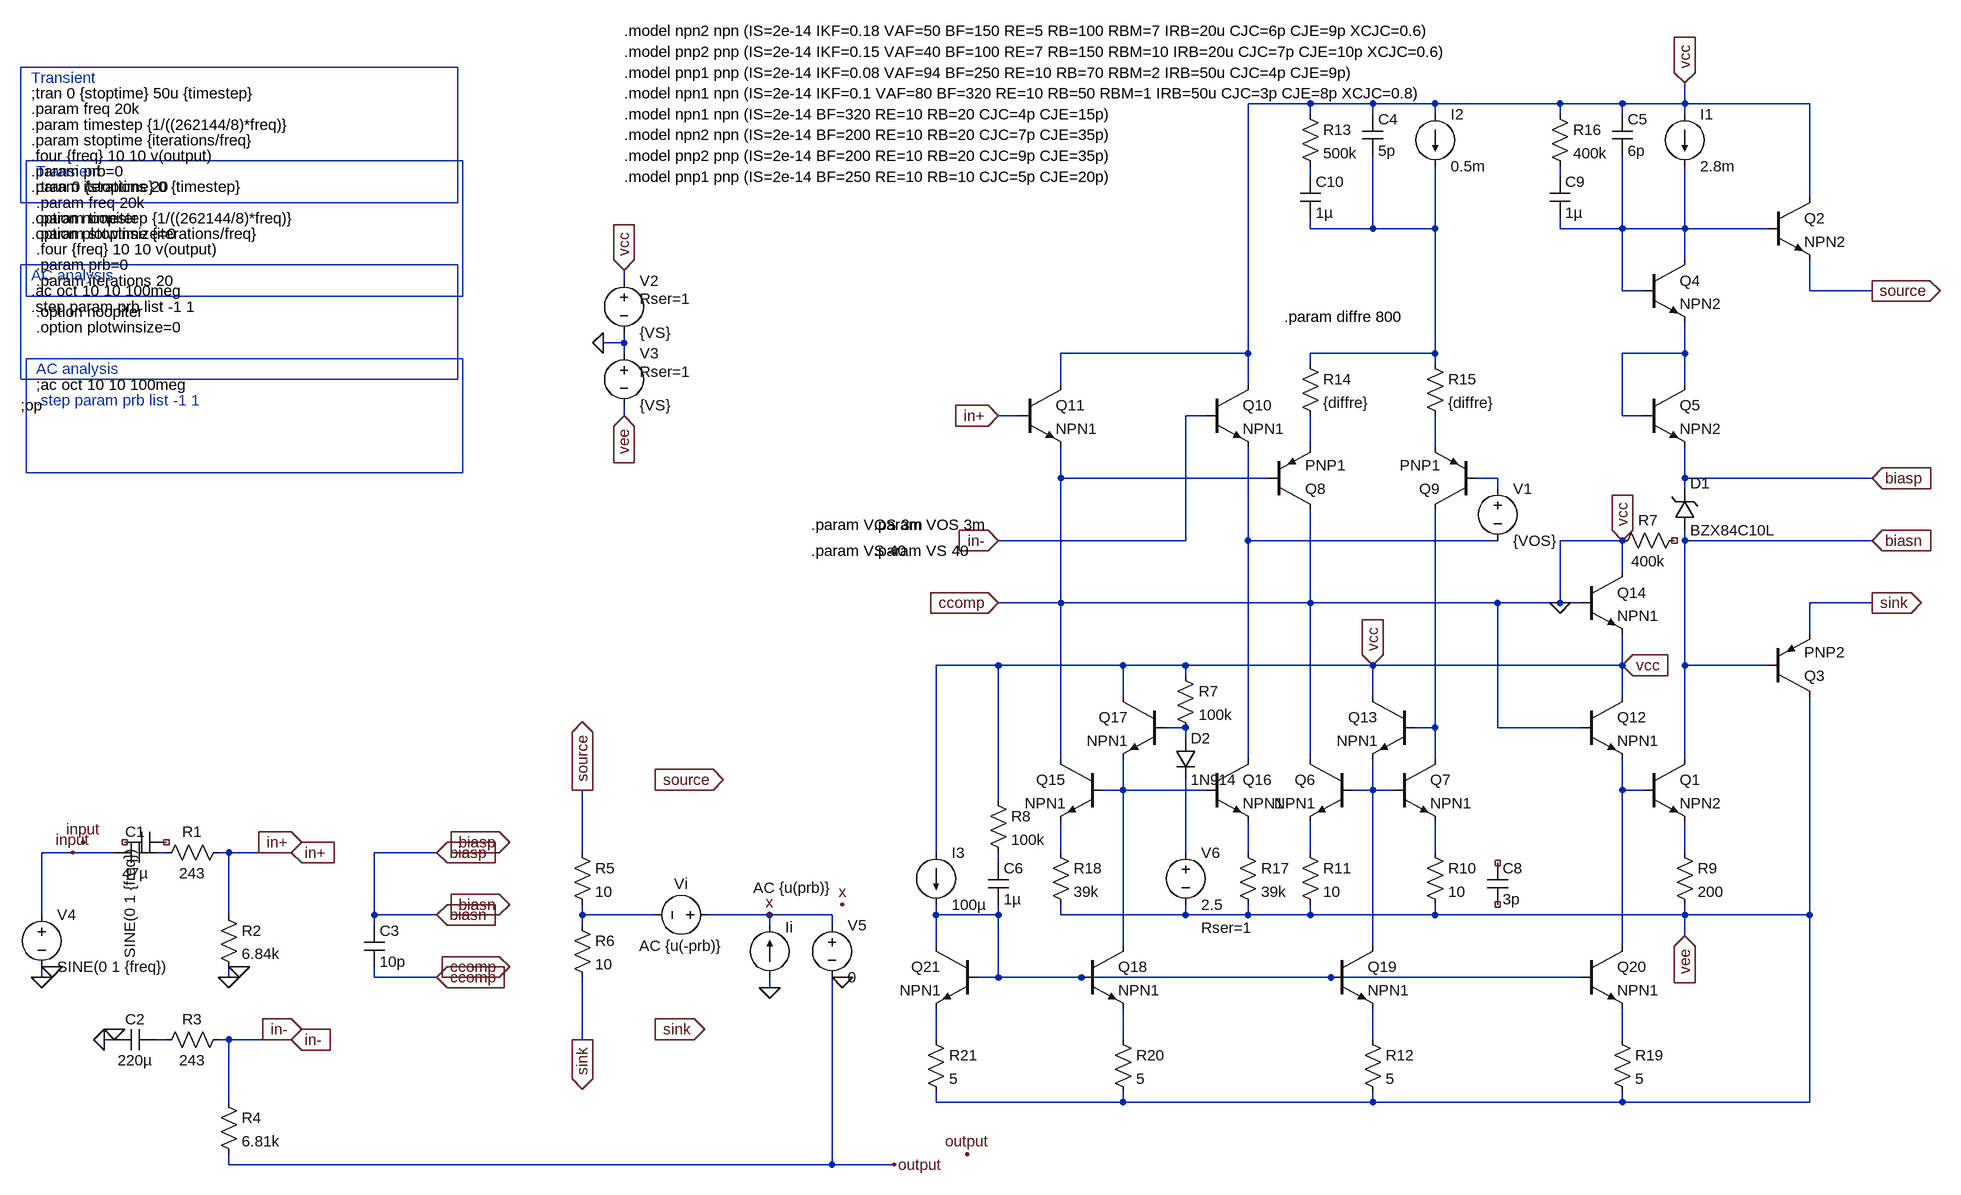
[diagram p0: schematic model_LME49810.asc]
model_LME49810.asc, the LTspice schematic file:
Version 4
SHEET 1 1204 680
WIRE 0 -1184 -96 -1184
WIRE 96 -1184 0 -1184
WIRE 192 -1184 96 -1184
WIRE 384 -1184 192 -1184
WIRE 480 -1184 384 -1184
WIRE 576 -1184 576 -1216
WIRE 576 -1184 480 -1184
WIRE 768 -1184 576 -1184
WIRE 0 -1168 0 -1184
WIRE 96 -1168 96 -1184
WIRE 192 -1168 192 -1184
WIRE 384 -1168 384 -1184
WIRE 480 -1168 480 -1184
WIRE 576 -1168 576 -1184
WIRE 0 -1072 0 -1088
WIRE 384 -1072 384 -1088
WIRE 768 -1040 768 -1184
WIRE 0 -992 0 -1008
WIRE 96 -992 96 -1104
WIRE 96 -992 0 -992
WIRE 192 -992 192 -1088
WIRE 192 -992 96 -992
WIRE 384 -992 384 -1008
WIRE 480 -992 480 -1104
WIRE 480 -992 384 -992
WIRE 576 -992 576 -1088
WIRE 576 -992 480 -992
WIRE 704 -992 576 -992
WIRE 576 -944 576 -992
WIRE -1056 -912 -1056 -928
WIRE 480 -896 480 -992
WIRE 512 -896 480 -896
WIRE 768 -896 768 -944
WIRE 864 -896 768 -896
WIRE -1056 -816 -1056 -832
WIRE -1056 -816 -1088 -816
WIRE -1056 -800 -1056 -816
WIRE -96 -800 -96 -1184
WIRE -96 -800 -384 -800
WIRE 192 -800 192 -992
WIRE 192 -800 0 -800
WIRE 576 -800 576 -848
WIRE 576 -800 480 -800
WIRE 0 -784 0 -800
WIRE 192 -784 192 -800
WIRE -384 -752 -384 -800
WIRE -96 -752 -96 -800
WIRE 576 -752 576 -800
WIRE -1056 -704 -1056 -720
WIRE -448 -704 -480 -704
WIRE -160 -704 -192 -704
WIRE 480 -704 480 -800
WIRE 512 -704 480 -704
WIRE 0 -656 0 -704
WIRE 192 -656 192 -704
WIRE -384 -608 -384 -656
WIRE -64 -608 -384 -608
WIRE 288 -608 256 -608
WIRE 576 -608 576 -656
WIRE 864 -608 576 -608
WIRE 288 -592 288 -608
WIRE 576 -592 576 -608
WIRE -192 -512 -192 -704
WIRE -192 -512 -480 -512
WIRE -96 -512 -96 -656
WIRE 288 -512 -96 -512
<<<<<<< .mine
WIRE 480 -512 384 -512
=======
>>>>>>> .r9
WIRE 576 -512 576 -528
WIRE 864 -512 576 -512
WIRE 480 -464 480 -512
WIRE 0 -416 0 -560
<<<<<<< .mine
WIRE 0 -416 -384 -416
WIRE 384 -416 384 -512
WIRE 384 -416 0 -416
=======
WIRE 0 -416 -480 -416
WIRE 288 -416 0 -416
WIRE 416 -416 384 -416
>>>>>>> .r9
WIRE 864 -416 768 -416
WIRE 768 -368 768 -416
WIRE -480 -320 -576 -320
WIRE -288 -320 -480 -320
WIRE -192 -320 -288 -320
WIRE 96 -320 -192 -320
WIRE 480 -320 480 -368
WIRE 480 -320 96 -320
WIRE 576 -320 576 -512
WIRE 704 -320 576 -320
WIRE -192 -304 -192 -320
WIRE -288 -272 -288 -320
WIRE 96 -272 96 -320
WIRE 480 -272 480 -320
WIRE -192 -224 -224 -224
WIRE 192 -224 192 -560
WIRE 192 -224 160 -224
WIRE 288 -224 288 -416
WIRE 416 -224 288 -224
WIRE -192 -208 -192 -224
WIRE -384 -176 -384 -608
WIRE -96 -176 -96 -512
WIRE 0 -176 0 -416
WIRE 192 -176 192 -224
WIRE 576 -176 576 -320
WIRE -288 -128 -288 -176
WIRE -288 -128 -320 -128
WIRE -160 -128 -288 -128
WIRE 96 -128 96 -176
WIRE 96 -128 64 -128
WIRE 128 -128 96 -128
WIRE 480 -128 480 -176
WIRE 512 -128 480 -128
WIRE -480 -112 -480 -320
WIRE -1904 -32 -1952 -32
WIRE -1840 -32 -1904 -32
WIRE -1760 -32 -1776 -32
WIRE -1664 -32 -1680 -32
WIRE -1568 -32 -1664 -32
WIRE -1344 -32 -1440 -32
WIRE -1120 -32 -1120 -128
WIRE -576 -32 -576 -320
WIRE -384 -32 -384 -80
WIRE -192 -32 -192 -144
WIRE -96 -32 -96 -80
WIRE 0 -32 0 -80
WIRE 192 -32 192 -80
WIRE 576 -32 576 -80
WIRE -480 -16 -480 -32
WIRE -1952 64 -1952 -32
WIRE -1664 64 -1664 -32
WIRE -1440 64 -1440 -32
WIRE -1344 64 -1440 64
WIRE -1120 64 -1120 48
WIRE -1008 64 -1120 64
WIRE -832 64 -928 64
WIRE -736 64 -832 64
WIRE -576 64 -576 48
WIRE -480 64 -480 48
WIRE -480 64 -576 64
WIRE -384 64 -384 48
WIRE -192 64 -192 48
WIRE -192 64 -384 64
WIRE -96 64 -96 48
WIRE -96 64 -192 64
WIRE 0 64 0 48
WIRE 0 64 -96 64
WIRE 192 64 192 48
WIRE 192 64 0 64
WIRE 576 64 576 48
WIRE 576 64 192 64
WIRE 768 64 768 -272
WIRE 768 64 576 64
WIRE -1440 80 -1440 64
WIRE -1120 80 -1120 64
WIRE -832 80 -832 64
WIRE -736 80 -736 64
WIRE 576 96 576 64
WIRE -576 112 -576 64
WIRE -288 112 -288 -128
WIRE 96 112 96 -128
WIRE 480 112 480 -128
WIRE -1952 160 -1952 144
WIRE -1664 160 -1664 144
WIRE -1440 160 -1440 144
WIRE -1344 160 -1440 160
WIRE -480 160 -480 64
WIRE -480 160 -512 160
WIRE -352 160 -480 160
WIRE 32 160 -352 160
WIRE 416 160 32 160
WIRE -832 176 -832 160
WIRE -1840 256 -1856 256
WIRE -1760 256 -1776 256
WIRE -1664 256 -1680 256
WIRE -1568 256 -1664 256
WIRE -1120 256 -1120 160
WIRE -576 256 -576 208
WIRE -288 256 -288 208
WIRE 96 256 96 208
WIRE 480 256 480 208
WIRE -1664 352 -1664 256
WIRE -576 352 -576 336
WIRE -288 352 -288 336
WIRE -288 352 -576 352
WIRE 96 352 96 336
WIRE 96 352 -288 352
WIRE 480 352 480 336
WIRE 480 352 96 352
WIRE 768 352 768 64
WIRE 768 352 480 352
WIRE -1664 448 -1664 432
WIRE -736 448 -736 160
WIRE -736 448 -1664 448
WIRE -640 448 -736 448
FLAG -480 -704 in+
IOPIN -480 -704 In
FLAG -480 -512 in-
IOPIN -480 -512 In
FLAG -480 -416 ccomp
IOPIN -480 -416 In
FLAG 576 96 vee
IOPIN 576 96 In
FLAG 576 -1216 vcc
IOPIN 576 -1216 In
FLAG 864 -896 source
IOPIN 864 -896 Out
FLAG 864 -416 sink
IOPIN 864 -416 Out
FLAG 864 -608 biasp
IOPIN 864 -608 In
FLAG 864 -512 biasn
IOPIN 864 -512 In
FLAG -1056 -928 vcc
IOPIN -1056 -928 In
FLAG -1056 -704 vee
IOPIN -1056 -704 In
FLAG -1088 -816 0
<<<<<<< .mine
FLAG -1936 144 0
FLAG -1648 144 0
FLAG -1552 -48 in+
IOPIN -1552 -48 In
FLAG -1840 240 0
FLAG -528 432 output
FLAG -1552 240 in-
IOPIN -1552 240 In
FLAG -1888 -48 input
FLAG -1232 -48 biasp
IOPIN -1232 -48 In
FLAG -1232 48 biasn
IOPIN -1232 48 In
FLAG -1232 144 ccomp
IOPIN -1232 144 In
FLAG -1008 -144 source
IOPIN -1008 -144 Out
FLAG -1008 240 sink
IOPIN -1008 240 Out
FLAG -720 160 0
FLAG -720 48 x
FLAG 480 -320 vcc
IOPIN 480 -320 In
FLAG 96 -320 vcc
IOPIN 96 -320 In
=======
FLAG -1952 160 0
FLAG -1664 160 0
FLAG -1568 -32 in+
IOPIN -1568 -32 In
FLAG -1856 256 0
FLAG -640 448 output
FLAG -1568 256 in-
IOPIN -1568 256 In
FLAG -1904 -32 input
FLAG -1344 -32 biasp
IOPIN -1344 -32 In
FLAG -1344 64 biasn
IOPIN -1344 64 In
FLAG -1344 160 ccomp
IOPIN -1344 160 In
FLAG -1120 -128 source
IOPIN -1120 -128 Out
FLAG -1120 256 sink
IOPIN -1120 256 Out
FLAG -832 176 0
FLAG -832 64 x
FLAG 384 -416 0
FLAG 480 -512 vcc
IOPIN 480 -512 In
>>>>>>> .r9
SYMBOL npn 512 -176 R0
SYMATTR InstName Q1
SYMATTR Value NPN2
SYMBOL current 576 -1168 R0
WINDOW 123 0 0 Left 0
WINDOW 39 0 0 Left 0
SYMATTR InstName I1
SYMATTR Value 2.8m
SYMBOL npn 704 -1040 R0
SYMATTR InstName Q2
SYMATTR Value NPN2
SYMBOL pnp 704 -272 M180
SYMATTR InstName Q3
SYMATTR Value PNP2
SYMBOL npn 512 -944 R0
SYMATTR InstName Q4
SYMATTR Value NPN2
SYMBOL npn 512 -752 R0
SYMATTR InstName Q5
SYMATTR Value NPN2
SYMBOL voltage -1056 -928 R0
WINDOW 123 0 0 Left 0
WINDOW 39 24 44 Left 0
SYMATTR SpiceLine Rser=1
SYMATTR InstName V2
SYMATTR Value {VS}
SYMBOL voltage -1056 -816 R0
WINDOW 123 0 0 Left 0
WINDOW 39 24 44 Left 0
SYMATTR SpiceLine Rser=1
SYMATTR InstName V3
SYMATTR Value {VS}
SYMBOL voltage -1952 48 R0
WINDOW 123 0 0 Left 0
WINDOW 39 0 0 Left 0
SYMATTR InstName V4
<<<<<<< .mine
SYMATTR Value SINE(0 1 {freq})
SYMBOL cap -1760 -64 R90
=======
SYMATTR Value SINE(0 1 {freq})
SYMBOL cap -1776 -48 R90
>>>>>>> .r9
WINDOW 0 0 32 VBottom 0
WINDOW 3 32 32 VTop 0
SYMATTR InstName C1
SYMATTR Value 47µ
SYMBOL res -1664 -48 R90
WINDOW 0 0 56 VBottom 0
WINDOW 3 32 56 VTop 0
SYMATTR InstName R1
SYMATTR Value 243
SYMBOL res -1680 48 R0
SYMATTR InstName R2
SYMATTR Value 6.84k
SYMBOL cap -1776 240 R90
WINDOW 0 0 32 VBottom 0
WINDOW 3 32 32 VTop 0
SYMATTR InstName C2
SYMATTR Value 220µ
SYMBOL res -1664 240 R90
WINDOW 0 0 56 VBottom 0
WINDOW 3 32 56 VTop 0
SYMATTR InstName R3
SYMATTR Value 243
SYMBOL res -1680 336 R0
SYMATTR InstName R4
SYMATTR Value 6.81k
SYMBOL cap -1456 80 R0
SYMATTR InstName C3
SYMATTR Value 10p
SYMBOL res -1136 -48 R0
SYMATTR InstName R5
SYMATTR Value 10
SYMBOL res -1136 64 R0
SYMATTR InstName R6
SYMATTR Value 10
SYMBOL current -832 160 M180
WINDOW 0 24 77 Left 0
WINDOW 3 24 0 Left 0
WINDOW 123 -25 138 Left 0
WINDOW 39 0 0 Left 0
SYMATTR InstName Ii
SYMATTR Value ""
SYMATTR Value2 AC {u(prb)}
SYMBOL voltage -912 64 M270
WINDOW 0 32 56 VTop 0
WINDOW 3 -32 56 VBottom 0
WINDOW 123 -32 56 VBottom 0
WINDOW 39 -32 56 VBottom 0
SYMATTR InstName Vi
SYMATTR Value ""
SYMATTR Value2 AC {u(-prb)}
SYMBOL voltage -736 64 R0
WINDOW 123 0 0 Left 0
WINDOW 39 0 0 Left 0
SYMATTR InstName V5
SYMATTR Value 0
SYMBOL cap 464 -1168 R0
SYMATTR InstName C5
SYMATTR Value 6p
SYMBOL zener 560 -528 M180
WINDOW 0 24 72 Left 0
WINDOW 3 24 0 Left 0
SYMATTR InstName D1
SYMATTR Value BZX84C10L
SYMATTR Description Diode
SYMATTR Type diode
SYMBOL npn 64 -176 M0
SYMATTR InstName Q6
SYMATTR Value NPN1
SYMBOL npn 128 -176 R0
SYMATTR InstName Q7
SYMATTR Value NPN1
SYMBOL res 176 -48 R0
SYMATTR InstName R10
SYMATTR Value 10
SYMBOL res -16 -48 R0
SYMATTR InstName R11
SYMATTR Value 10
SYMBOL pnp -64 -560 M180
SYMATTR InstName Q8
SYMATTR Value PNP1
SYMBOL pnp 256 -560 R180
SYMATTR InstName Q9
SYMATTR Value PNP1
SYMBOL current 192 -1168 R0
WINDOW 123 0 0 Left 0
WINDOW 39 0 0 Left 0
SYMATTR InstName I2
SYMATTR Value 0.5m
SYMBOL cap 80 -1168 R0
SYMATTR InstName C4
SYMATTR Value 5p
SYMBOL res -16 -1184 R0
SYMATTR InstName R13
SYMATTR Value 500k
SYMBOL res -16 -800 R0
SYMATTR InstName R14
SYMATTR Value {diffre}
SYMBOL res 176 -800 R0
SYMATTR InstName R15
SYMATTR Value {diffre}
SYMBOL voltage 288 -608 R0
WINDOW 123 0 0 Left 0
WINDOW 39 0 0 Left 0
SYMATTR InstName V1
SYMATTR Value {VOS}
SYMBOL npn -160 -752 R0
SYMATTR InstName Q10
SYMATTR Value NPN1
SYMBOL npn -448 -752 R0
SYMATTR InstName Q11
SYMATTR Value NPN1
SYMBOL npn 416 -272 R0
SYMATTR InstName Q12
SYMATTR Value NPN1
SYMBOL npn 160 -272 M0
SYMATTR InstName Q13
SYMATTR Value NPN1
SYMBOL cap -16 -1072 R0
SYMATTR InstName C10
SYMATTR Value 1µ
SYMBOL res 560 -48 R0
SYMATTR InstName R9
SYMATTR Value 200
SYMBOL res 368 -1184 R0
SYMATTR InstName R16
SYMATTR Value 400k
SYMBOL cap 368 -1072 R0
SYMATTR InstName C9
SYMATTR Value 1µ
SYMBOL npn 416 -464 R0
SYMATTR InstName Q14
SYMATTR Value NPN1
SYMBOL npn -320 -176 M0
SYMATTR InstName Q15
SYMATTR Value NPN1
SYMBOL npn -160 -176 R0
SYMATTR InstName Q16
SYMATTR Value NPN1
SYMBOL res -112 -48 R0
SYMATTR InstName R17
SYMATTR Value 39k
SYMBOL res -400 -48 R0
SYMATTR InstName R18
SYMATTR Value 39k
SYMBOL npn -224 -272 M0
SYMATTR InstName Q17
SYMATTR Value NPN1
SYMBOL res -208 -320 R0
SYMATTR InstName R7
SYMATTR Value 100k
SYMBOL voltage -192 -48 R0
WINDOW 123 0 0 Left 0
WINDOW 39 24 132 Left 0
SYMATTR SpiceLine Rser=1
SYMATTR InstName V6
SYMATTR Value 2.5
SYMBOL diode -208 -208 R0
SYMATTR InstName D2
SYMATTR Value 1N914
SYMBOL npn -352 112 R0
SYMATTR InstName Q18
SYMATTR Value NPN1
SYMBOL npn 32 112 R0
SYMATTR InstName Q19
SYMATTR Value NPN1
SYMBOL npn 416 112 R0
SYMATTR InstName Q20
SYMATTR Value NPN1
SYMBOL res 80 240 R0
SYMATTR InstName R12
SYMATTR Value 5
SYMBOL res 464 240 R0
SYMATTR InstName R19
SYMATTR Value 5
SYMBOL res -304 240 R0
SYMATTR InstName R20
SYMATTR Value 5
SYMBOL npn -512 112 M0
SYMATTR InstName Q21
SYMATTR Value NPN1
SYMBOL res -592 240 R0
SYMATTR InstName R21
SYMATTR Value 5
SYMBOL current -576 -32 R0
WINDOW 123 0 0 Left 0
WINDOW 39 0 0 Left 0
SYMATTR InstName I3
SYMATTR Value 100µ
SYMBOL res -496 -128 R0
SYMATTR InstName R8
<<<<<<< .mine
SYMATTR Value 100k
SYMBOL cap 272 -16 R0
SYMATTR InstName C8
SYMATTR Value 3p
SYMBOL res 576 -528 R90
WINDOW 0 0 56 VBottom 0
WINDOW 3 32 56 VTop 0
SYMATTR InstName R7
SYMATTR Value 1e9
TEXT -672 -536 Left 0 !.param VOS 3m
TEXT -1056 -1168 Left 0 !.model npn1 npn (IS=2e-14 BF=320 RE=10 RB=20 CJC=4p CJE=15p)
TEXT -1056 -1136 Left 0 !.model npn2 npn (IS=2e-14 BF=200 RE=10 RB=20 CJC=7p CJE=35p)
TEXT -1056 -1104 Left 0 !.model pnp2 pnp (IS=2e-14 BF=200 RE=10 RB=20 CJC=9p CJE=35p)
TEXT -672 -496 Left 0 !.param VS 40
TEXT -1056 -1072 Left 0 !.model pnp1 pnp (IS=2e-14 BF=250 RE=10 RB=10 CJC=5p CJE=20p)
=======
SYMATTR Value 400k
SYMBOL cap -496 -16 R0
SYMATTR InstName C6
SYMATTR Value 1µ
TEXT -768 -536 Left 0 !.param VOS 3m
TEXT -1056 -1200 Left 0 !.model npn1 npn (IS=2e-14 IKF=0.1 VAF=80 BF=320 RE=10 RB=50 RBM=1 IRB=50u CJC=3p CJE=8p XCJC=0.8)
TEXT -1056 -1296 Left 0 !.model npn2 npn (IS=2e-14 IKF=0.18 VAF=50 BF=150 RE=5 RB=100 RBM=7 IRB=20u CJC=6p CJE=9p XCJC=0.6)
TEXT -1056 -1264 Left 0 !.model pnp2 pnp (IS=2e-14 IKF=0.15 VAF=40 BF=100 RE=7 RB=150 RBM=10 IRB=20u CJC=7p CJE=10p XCJC=0.6)
TEXT -768 -496 Left 0 !.param VS 40
TEXT -1056 -1232 Left 0 !.model pnp1 pnp (IS=2e-14 IKF=0.08 VAF=94 BF=250 RE=10 RB=70 RBM=2 IRB=50u CJC=4p CJE=9p)
>>>>>>> .r9
TEXT -40 -856 Left 0 !.param diffre 800
<<<<<<< .mine
TEXT -1960 -840 Left 0 !.option plotwinsize=0
TEXT -1960 -864 Left 0 !.option noopiter
TEXT -1960 -1056 Left 0 !.tran 0 {stoptime} 0 {timestep}
TEXT -1960 -1080 Left 0 ;Transient
TEXT -1960 -960 Left 0 !.four {freq} 10 10 v(output)
TEXT -1960 -936 Left 0 !.param prb=0
TEXT -1960 -1008 Left 0 !.param timestep {1/((262144/8)*freq)}
TEXT -1960 -1032 Left 0 !.param freq 20k
TEXT -1960 -984 Left 0 !.param stoptime {iterations/freq}
TEXT -1960 -752 Left 0 !;ac oct 10 10 100meg
TEXT -1960 -728 Left 0 ;.step param prb list -1 1
TEXT -1960 -776 Left 0 ;AC analysis
TEXT -1960 -912 Left 0 !.param iterations 20
RECTANGLE Normal -1304 -1096 -1976 -888
RECTANGLE Normal -1304 -792 -1976 -616
=======
TEXT -1968 -984 Left 0 !.option plotwinsize=0
TEXT -1968 -1008 Left 0 !.option noopiter
TEXT -1968 -1200 Left 0 !;tran 0 {stoptime} 50u {timestep}
TEXT -1968 -1224 Left 0 ;Transient
TEXT -1968 -1104 Left 0 !.four {freq} 10 10 v(output)
TEXT -1968 -1080 Left 0 !.param prb=0
TEXT -1968 -1152 Left 0 !.param timestep {1/((262144/8)*freq)}
TEXT -1968 -1176 Left 0 !.param freq 20k
TEXT -1968 -1128 Left 0 !.param stoptime {iterations/freq}
TEXT -1968 -896 Left 0 !.ac oct 10 10 100meg
TEXT -1968 -872 Left 0 !.step param prb list -1 1
TEXT -1968 -920 Left 0 ;AC analysis
TEXT -1968 -1056 Left 0 !.param iterations 20
TEXT -1984 -720 Left 0 !;op
RECTANGLE Normal -1312 -1240 -1984 -1032
RECTANGLE Normal -1312 -936 -1984 -760
>>>>>>> .r9

The netlist it stands for:
* model_LME49810.asc
Q1 biasn N014 N021 0 NPN2
I1 0 N004 2.8m
Q2 0 N004 source 0 NPN2
Q3 vee biasn sink 0 PNP2
Q4 N004 N004 N005 0 NPN2
Q5 N005 N005 biasn 0 NPN2
V2 0 0 {VS} Rser=1
V3 0 vee {VS} Rser=1
V4 input 0 SINE(0 1 {freq})
C§? NC_01 NC_02 SINE(0 1 {freq})
C1 N015 input 47µ
R1 in+ N015 243
R2 in+ 0 6.84k
C2 N025 0 220µ
R3 in- N025 243
R4 in- output 6.81k
C3 biasn 0 10p
R5 source N023 10
R6 N023 sink 10
Ii 0 x AC {u(prb)}
Vi x N023 AC {u(-prb)}
V5 x output 0
C5 0 N004 6p
D1 biasn biasn BZX84C10L
Q6 0 N013 N019 0 NPN1
Q7 N011 N013 N020 0 NPN1
R10 N020 vee 10
R11 N019 vee 10
Q8 0 0 N006 0 PNP1
Q9 N011 N008 N007 0 PNP1
I2 0 N003 0.5m
C4 0 N003 5p
R13 0 N001 500k
R14 N003 N006 {diffre}
R15 N003 N007 {diffre}
V1 N008 N009 {VOS}
Q10 0 in- N009 0 NPN1
Q11 0 in+ 0 0 NPN1
Q12 0 0 N014 0 NPN1
Q13 0 N011 N013 0 NPN1
C10 N001 N003 1µ
R9 N021 vee 200
R16 0 N002 400k
C9 N002 N004 1µ
Q14 0 0 0 0 NPN1
Q15 0 N012 N016 0 NPN1
Q16 N009 N012 N018 0 NPN1
R17 N018 vee 39k
R18 N016 vee 39k
Q17 0 N010 N012 0 NPN1
R7 0 N010 100k
V6 N017 vee 2.5 Rser=1
D2 N010 N017 1N914
Q18 N012 N024 N027 0 NPN1
Q19 N013 N024 N028 0 NPN1
Q20 N014 N024 N029 0 NPN1
R12 N028 vee 5
R19 N029 vee 5
R20 N027 vee 5
Q21 N024 N024 N026 0 NPN1
R21 N026 vee 5
I3 0 N024 100µ
R8 0 N022 100k
C8 NC_03 NC_04 3p
R7 NC_05 0 400k
C6 N022 N024 1µ
.model D D
.lib standard.dio
.model NPN NPN
.model PNP PNP
.lib standard.bjt
.param VOS 3m
.model npn1 npn (IS=2e-14 BF=320 RE=10 RB=20 CJC=4p CJE=15p)
.model npn2 npn (IS=2e-14 BF=200 RE=10 RB=20 CJC=7p CJE=35p)
.model pnp2 pnp (IS=2e-14 BF=200 RE=10 RB=20 CJC=9p CJE=35p)
.param VS 40
.model pnp1 pnp (IS=2e-14 BF=250 RE=10 RB=10 CJC=5p CJE=20p)
.param VOS 3m
.model npn1 npn (IS=2e-14 IKF=0.1 VAF=80 BF=320 RE=10 RB=50 RBM=1 IRB=50u CJC=3p CJE=8p XCJC=0.8)
.model npn2 npn (IS=2e-14 IKF=0.18 VAF=50 BF=150 RE=5 RB=100 RBM=7 IRB=20u CJC=6p CJE=9p XCJC=0.6)
.model pnp2 pnp (IS=2e-14 IKF=0.15 VAF=40 BF=100 RE=7 RB=150 RBM=10 IRB=20u CJC=7p CJE=10p XCJC=0.6)
.param VS 40
.model pnp1 pnp (IS=2e-14 IKF=0.08 VAF=94 BF=250 RE=10 RB=70 RBM=2 IRB=50u CJC=4p CJE=9p)
.param diffre 800
.option plotwinsize=0
.option noopiter
.tran 0 {stoptime} 0 {timestep}
* Transient
.four {freq} 10 10 v(output)
.param prb=0
.param timestep {1/((262144/8)*freq)}
.param freq 20k
.param stoptime {iterations/freq}
;ac oct 10 10 100meg
* .step param prb list -1 1
* AC analysis
.param iterations 20
.option plotwinsize=0
.option noopiter
;tran 0 {stoptime} 50u {timestep}
* Transient
.four {freq} 10 10 v(output)
.param prb=0
.param timestep {1/((262144/8)*freq)}
.param freq 20k
.param stoptime {iterations/freq}
.ac oct 10 10 100meg
.step param prb list -1 1
* AC analysis
.param iterations 20
;op
.backanno
.end